# Altium schematic sheet TUDSSL_condenar__Hardware_PCBs_Mainboard_Board_TUD-V2-EnergyHarvestingConsole_TUD-EnergyHarvestingConsole_1__5_Logging.schdoc
size 309 x 223 mm; Symbol: Sheet-Symbol_A4; Device: Sheet-Symbol_A4; Company: EasyEDA.com; Drawed: EasyEDA Pro; Reviewed: EasyEDA Pro; Version: V0.1; Page Size: A4; @Project Name: TUD-EnergyHarvestingConsole_2022-08-29_17-01-09; @Page Count: 9; @Update Date: 2023-01-07; @Create Date: 2022-09-23; @Schematic Name: TUD-EnergyHarvestingConsole_1; Part Number: JLCPCB-002; @Page No: 9; @Page Name: Logging
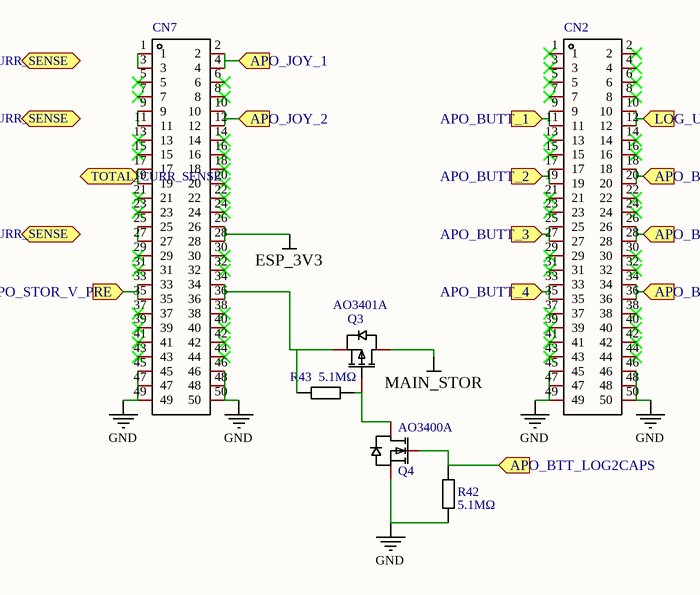
[diagram p0: TUDSSL_condenar__Hardware_PCBs_Mainboard_Board_TUD-V2-EnergyHarvestingConsole_TUD-EnergyHarvestingConsole_1__5_Logging.schdoc]

## Parts
CN2  DF40C-50DS-0.4V(51)  [CONN-SMD_DF40C-50DS-0.4V51]  (value not drawn)
CN7  DF40C-50DS-0.4V(51)  [CONN-SMD_DF40C-50DS-0.4V51]  (value not drawn)
Q3  AO3401A  [SOT-23_L2.9-W1.3-P1.90-LS2.4-BR]
Q4  AO3400A  [SOT-23-3_L2.9-W1.3-P1.90-LS2.4-BR]
R42  5.1MΩ  [R0603]
R43  5.1MΩ  [R0603]

## Ports
APO_BTT_LOG2CAPS (in), APO_BUTT_1 (in), APO_BUTT_2 (in), APO_BUTT_3 (in), APO_BUTT_4 (in), APO_BUTT_5 (in), APO_BUTT_6 (in), APO_BUTT_7 (in), APO_JOY_1 (in), APO_JOY_2 (in), APO_STOR_V_PRE (in), CRANK2_CURR_SENSE (bidir), CRANK_CURR_SENSE (bidir), LOG_UART_RX (in), SOLAR_CURR_SENSE (bidir), TOTAL_CURR_SENSE (bidir)

## Nets
ESP_3V3: CN7.26 CN7.28
GND: CN2.45 CN2.46 CN2.47 CN2.48 CN2.49 CN2.50 CN7.45 CN7.46 CN7.47 CN7.48 CN7.49 CN7.50 Q4.2(S) R42.2
MAIN_STOR: Q3.3(D)
APO_BTT_LOG2CAPS: Q4.1(G) R42.1 ; port APO_BTT_LOG2CAPS
APO_BUTT_1: CN2.9 CN2.11 ; port APO_BUTT_1
APO_BUTT_2: CN2.17 CN2.19 ; port APO_BUTT_2
APO_BUTT_3: CN2.25 CN2.27 ; port APO_BUTT_3
APO_BUTT_4: CN2.33 CN2.35 ; port APO_BUTT_4
APO_BUTT_5: CN2.34 CN2.36 ; port APO_BUTT_5
APO_BUTT_6: CN2.26 CN2.28 ; port APO_BUTT_6
APO_BUTT_7: CN2.18 CN2.20 ; port APO_BUTT_7
APO_JOY_1: CN7.2 CN7.4 ; port APO_JOY_1
APO_JOY_2: CN7.10 CN7.12 ; port APO_JOY_2
APO_STOR_V_PRE: CN7.33 CN7.35 ; port APO_STOR_V_PRE
LOG_UART_RX: CN2.10 CN2.12 ; port LOG_UART_RX
NetCN7_1: CN7.1 CN7.3
NetCN7_9: CN7.9 CN7.11
NetCN7_17: CN7.17 CN7.19
NetCN7_25: CN7.25 CN7.27
NetCN7_34: CN7.34 CN7.36 Q3.2(S) R43.2
NetQ3_1: Q3.1(G) Q4.3(D) R43.1

Not connected (* = marked no-connect by the designer): CN2 1* 2* 3* 4* 5* 6* 7* 8* 13* 14* 15* 16* 21* 22* 23* 24* 29* 30* 31* 32* 37* 38* 39* 40* 41* 42* 43* 44*; CN7 5* 6* 7* 8* 13* 14* 15* 16* 18* 20* 21* 22* 23* 24* 29* 30* 31* 32* 37* 38* 39* 40* 41* 42* 43* 44*

## Notes on the sheet
- 1
- 2
- 3
- 4
- 5
- 6
- A
- B
- C
- Schematic
- TUD-EnergyHarvestingConsole_1
- Create Date
- Update Date
- 2023-01-07
- 2022-09-23
- Reviewed
- Drawed
- Page
- EasyEDA Pro
- Logging
- Part Number
- TUD-EnergyHarvestingConsole_2022-08-29_17-01-09
- JLCPCB-002
- D
- VER
- SIZE
- PAGE
- 9
- OF
- V0.1
- A4
- EasyEDA.com

## Library data of the parts
CN2 CN7 = DF40C-50DS-0.4V(51): Number of Pins:50 Pitch:0.4mm Number of Rows:2 Gender:Female Mounting Style:Brick nogging Current Rating (Max):300mA Operating Temperature Range:-35℃~+85℃ Operating Temperature Range:-35℃~+85℃; Manufacturer: HRS(广濑); Add into BOM: yes; Pitch: 0.4mm; Gender: Female; Current Rating (Max): 300mA; Name: DF40C-50DS-0.4V(51); Symbol: DF40C-50DS-0.4V(51); Device: DF40C-50DS-0.4V(51); LCSC Part Name: BTB板对板,DF40系列,0.4间距,50PIN母座; Supplier Part: C424646; Manufacturer Part: DF40C-50DS-0.4V(51); Supplier Footprint: SMD,P=0.4mm; JLCPCB Part Class: Extended Part; Datasheet: https://atta.szlcsc.com/upload/public/pdf/source/20190903/C424646_C53374841C54EEA8B7C761CBAA198FD9.pdf; Supplier: LCSC; Convert to PCB: yes; Number of Pins: 50; Number of Rows: 2; Mounting Style: Brick nogging; Operating Temperature Range: -35℃~+85℃
Q3 = AO3401A: Manufacturer: AOS; Convert to PCB: yes; Name: AO3401A; Symbol: AO3401A; Device: AO3401A; Supplier: LCSC; Manufacturer Part: AO3401A; Supplier Part: C15127; JLCPCB Part Class: Basic Part; Add into BOM: yes; Origin Footprint: SOT-23_L2.9-W1.3-P1.90-LS2.4-BR
Q4 = AO3400A: Manufacturer: HUASHUO(华朔); Convert to PCB: yes; Name: AO3400A; Symbol: AO3400A; Device: AO3400A; Supplier: LCSC; Supplier Part: C700953; Manufacturer Part: AO3400A; JLCPCB Part Class: Extended Part; Add into BOM: yes; Origin Footprint: SOT-23-3_L2.9-W1.3-P1.90-LS2.4-BR
R42 R43 = 0603WAF5104T5E: Manufacturer: UniOhm; Resistance: 5.1M; Convert to PCB: yes; Name: 5.1MΩ; Symbol: 5.1MΩ; Device: 0603WAF5104T5E; Supplier: LCSC; Manufacturer Part: 0603WAF5104T5E; Supplier Part: C13320; JLCPCB Part Class: Basic Part; Add into BOM: yes; Origin Footprint: R0603